# Altium schematic sheet jn5169_blk.SchDoc
size A4; Date: 1/11/2016; Engineer: JBayalas; DocumentNumber: 9; Revision: V1.0; SheetNumber: 9; SheetTotal: 11
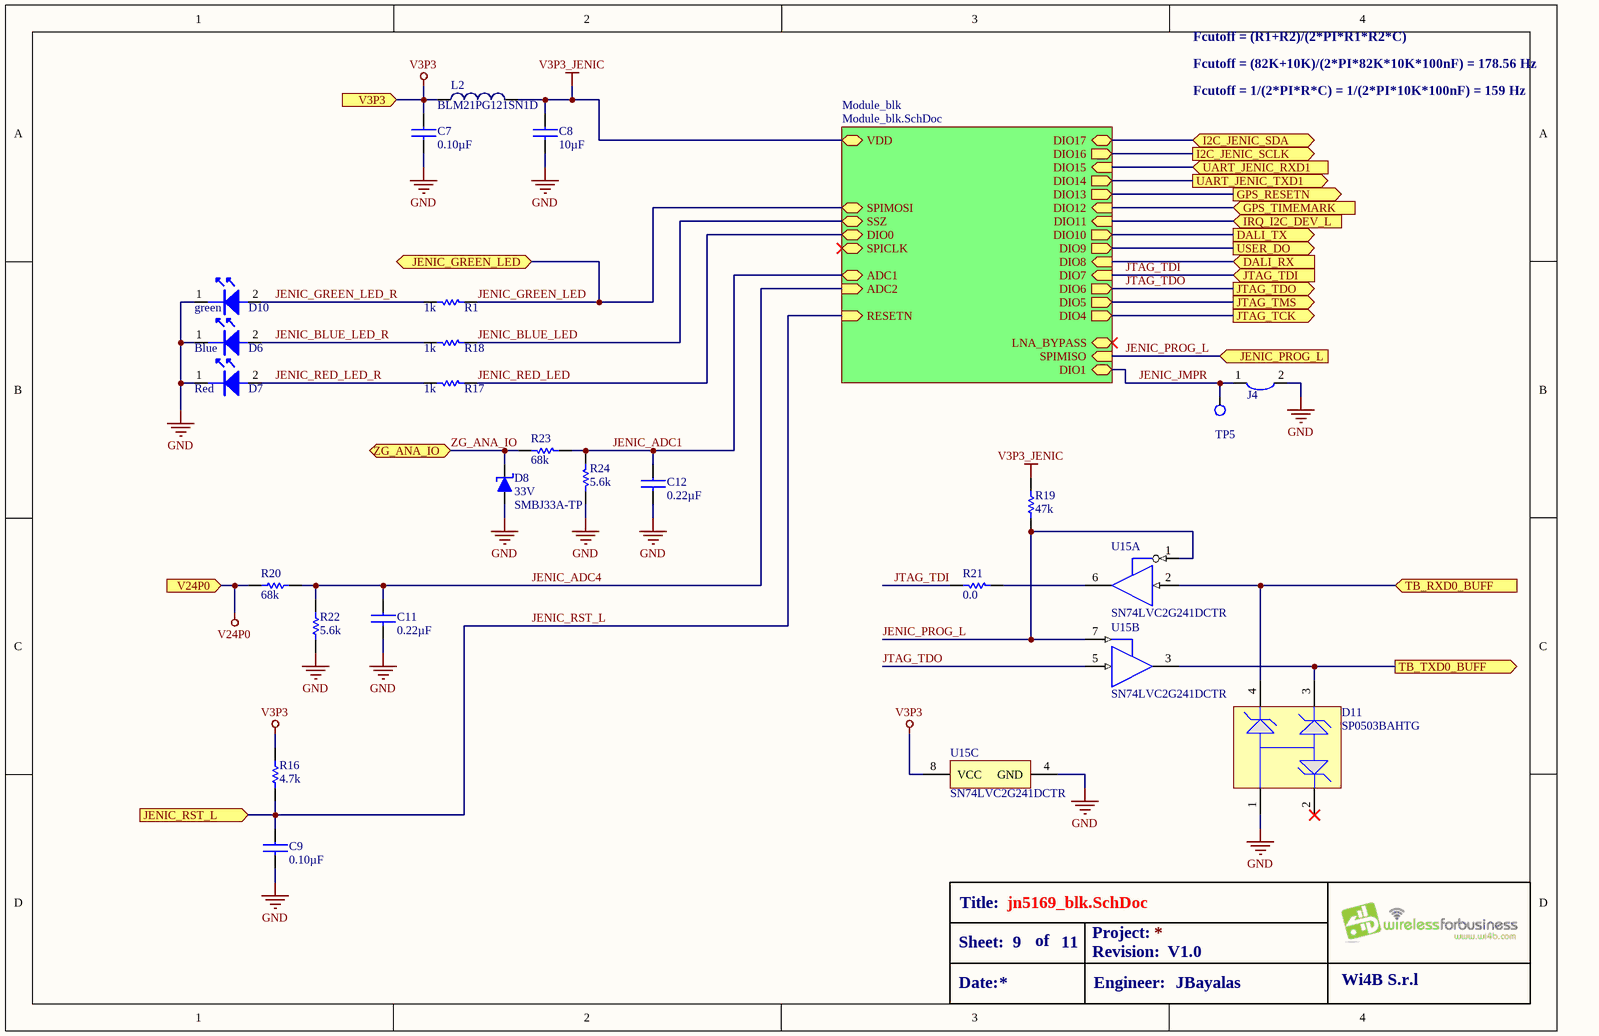
[diagram p0: jn5169_blk.SchDoc]

## Parts
C7  value 0.10µF  [C0402]  (hidden comment: GRM155R71H104ME14D)
C8  value 10µF  [C1206]  (hidden comment: GRM31CR71C106KAC7L)
C9  value 0.10µF  [C0402]  (hidden comment: GRM155R71H104ME14D)
C11  value 0.22µF  [C0603]  (hidden comment: GCM188R71H224KA64D)
C12  value 0.22µF  [C0603]  (hidden comment: GCM188R71H224KA64D)
D6  value Blue  [LED0402(BLUE)]  (hidden comment: VLMB1500-GS08)
D7  value Red  [LED0402(RED)]  (hidden comment: VLMS1500-GS08)
D8  RATING: 33V  [DO-214AA, SMB]  (hidden comment: SMBJ33A-TP)
D10  value green  [LED0402(GREEN)]  (hidden comment: XZVG68W-2)
D11  SP0503BAHTG  [LFUS-SOT143-4_V]
J4  0603 Jumper  [0603 Jumper]  (value not drawn)
L2  BLM21PG121SN1D  [0805 INDUCTOR]
R1  value 1k  [R0402]  (hidden comment: MCS04020C1001FE000)
R16  value 4.7k  [R0402]  (hidden comment: MCS04020C4701FE000)
R17  value 1k  [R0402]  (hidden comment: MCS04020C1001FE000)
R18  value 1k  [R0402]  (hidden comment: MCS04020C1001FE000)
R19  value 47k  [R0402]  (hidden comment: RC0402FR-0747KL)
R20  value 68k  [R0603]  (hidden comment: ERA-3AEB683V)
R21  value 0.0  [R0402]  (hidden comment: *)
R22  value 5.6k  [R0603]  (hidden comment: ERA-3AEB562V)
R23  value 68k  [R0603]  (hidden comment: ERA-3AEB683V)
R24  value 5.6k  [R0603]  (hidden comment: ERA-3AEB562V)
TP5  Test Point_2mm  [Test Point 2mm]  (value not drawn)
U15  SN74LVC2G241DCTR  [DCT0008A_L]  (parts A,B,C of 3)

## Sub-sheets
Module_blk = Module_blk.SchDoc: ADC1 (bidir), SPICLK (bidir), SPIMISO (in), SPIMOSI (bidir), SSZ (bidir), DIO0 (bidir), DIO1 (bidir), LNA_BYPASS (bidir), VDD (bidir), DIO10 (out), DIO9 (out), DIO8 (in), DIO7 (in), DIO6 (out), DIO5 (out), DIO4 (out), DIO17 (bidir), DIO16 (out), DIO15 (in), DIO14 (out), RESETN (in), DIO13 (out), DIO12 (in), DIO11 (in), ADC2 (in)

## Ports
DALI_RX (in), DALI_TX (out), GPS_RESETN (out), GPS_TIMEMARK (in), I2C_JENIC_SCLK (out), I2C_JENIC_SDA (bidir), IRQ_I2C_DEV_L (in), JENIC_GREEN_LED (bidir), JENIC_PROG_L (in), JENIC_RST_L (in), JTAG_TCK (out), JTAG_TDI (in), JTAG_TDO (out), JTAG_TMS (out), TB_RXD0_BUFF (in), TB_TXD0_BUFF (out), UART_JENIC_RXD1 (in), UART_JENIC_TXD1 (out), USER_DO (out), V3P3 (in), V24P0 (in), ZG_ANA_IO (bidir)

## Nets
GND: C7.2 C8.2 C9.2 C11.2 C12.2 D6.1 D7.1 D8.2(A) D10.1 D11.1 J4.2 R22.1 R24.1 U15.4(GND)
V3P3: C7.1 L2.2 R16.2 U15.8(VCC) ; port V3P3
V3P3_JENIC: C8.1 L2.1 R19.2 ; sheet Module_blk/VDD
V24P0: R20.2 ; port V24P0
DALI_RX: port DALI_RX, sheet Module_blk/DIO8
DALI_TX: port DALI_TX, sheet Module_blk/DIO10
GPS_RESETN: port GPS_RESETN, sheet Module_blk/DIO13
GPS_TIMEMARK: port GPS_TIMEMARK, sheet Module_blk/DIO12
I2C_JENIC_SCLK: port I2C_JENIC_SCLK, sheet Module_blk/DIO16
I2C_JENIC_SDA: port I2C_JENIC_SDA, sheet Module_blk/DIO17
IRQ_I2C_DEV_L: port IRQ_I2C_DEV_L, sheet Module_blk/DIO11
JENIC_ADC1: C12.1 R23.2 R24.2 ; sheet Module_blk/ADC1
JENIC_ADC4: C11.1 R20.1 R22.2 ; sheet Module_blk/ADC2
JENIC_BLUE_LED: R18.2 ; sheet Module_blk/SSZ
JENIC_BLUE_LED_R: D6.2 R18.1
JENIC_GREEN_LED: R1.2 ; port JENIC_GREEN_LED, sheet Module_blk/SPIMOSI
JENIC_GREEN_LED_R: D10.2 R1.1
JENIC_JMPR: J4.1 TP5.1 ; sheet Module_blk/DIO1
JENIC_PROG_L: R19.1 U15.1(1~{OE}) U15.7(2OE) ; port JENIC_PROG_L, sheet Module_blk/SPIMISO
JENIC_RED_LED: R17.2 ; sheet Module_blk/DIO0
JENIC_RED_LED_R: D7.2 R17.1
JENIC_RST_L: C9.1 R16.1 ; port JENIC_RST_L, sheet Module_blk/RESETN
JTAG_TCK: port JTAG_TCK, sheet Module_blk/DIO4
JTAG_TDI: R21.1 ; port JTAG_TDI, sheet Module_blk/DIO7
JTAG_TDO: U15.5(2A) ; port JTAG_TDO, sheet Module_blk/DIO6
JTAG_TMS: port JTAG_TMS, sheet Module_blk/DIO5
TB_RXD0_BUFF: D11.4 U15.2(1A) ; port TB_RXD0_BUFF
TB_TXD0_BUFF: D11.3 U15.3(2Y) ; port TB_TXD0_BUFF
UART_JENIC_RXD1: port UART_JENIC_RXD1, sheet Module_blk/DIO15
UART_JENIC_TXD1: port UART_JENIC_TXD1, sheet Module_blk/DIO14
USER_DO: port USER_DO, sheet Module_blk/DIO9
ZG_ANA_IO: D8.1(K) R23.1 ; port ZG_ANA_IO
NetR21_2: R21.2 U15.6(1Y)

Not connected (* = marked no-connect by the designer): D11 2*

## Notes on the sheet
- Fcutoff = (R1+R2)/(2*PI*R1*R2*C)
- Fcutoff = (82K+10K)/(2*PI*82K*10K*100nF) = 178.56 Hz
- Fcutoff = 1/(2*PI*R*C) = 1/(2*PI*10K*100nF) = 159 Hz
- Title:
- Sheet:
- Date:
- of
- Project:
- Revision:
- Engineer:
- Wi4B S.r.l

## Library data of the parts
C7 C9 = GRM155R71H104ME14D: CAP CER 0.1UF 50V X7R 0402; MFT: Murata Electronics North America; TYPE: SMD; MPN: GRM155R71H104ME14D; RATING: 50V; DNP: *
C8 = GRM31CR71C106KAC7L: CAP CER 10UF 16V X7R 1206; MFT: Murata Electronics North America; TYPE: SMD; MPN: GRM31CR71C106KAC7L; RATING: 16V; DNP: *
C11 C12 = GCM188R71H224KA64D: CAP CER 0.22UF 50V X7R 0603; MFT: Murata Electronics North America; TYPE: Surface Mount, MLCC; MPN: GCM188R71H224KA64D; RATING: 50V
D6 = VLMB1500-GS08: LED BLUE 0402 SMD; MFT: Vishay Semiconductor Opto Division; MPN: VLMB1500-GS08; TYPE: SMD; RATING: *; DNP: *
D7 = VLMS1500-GS08: LED RED 0402 SMD; MFT: Vishay Semiconductor Opto Division; MPN: VLMS1500-GS08; TYPE: SMD; RATING: *; DNP: *
D8 = SMBJ33A-TP: TVS DIODE 33VWM 53.3VC SMB; MFT: Micro Commercial Co; TYPE: Surface Mount; VALUE: SMBJ33A-TP; MPN: SMBJ33A-TP
D10 = XZVG68W-2: LED GREEN CLEAR CHIP SMD; MFT: SunLED; MPN: XZVG68W-2; RATING: *; LOAD: *; TYPE: SMD
D11 = CMP-2000-05191-1: TVS Diode Array, 30 pF, 30 KV, -40 to 85 degC, 4-Pin SOT143, RoHS, Tape and Reel; Manufacturer: Littelfuse; Direction Type: Uni-Directional; Product Height (mm): 1.05mm; Leakage Current (Max): 0.1uA; Clamping Voltage (Max): 8V; Reverse Stand-off Voltage: 5.5(Min)V; Configuration: Triple; Working Voltage: 5.5V; Product Length (mm): 3.04mm; Working Voltage (Max): 5.5V(Min); Capacitance Value: 30pF; Rad Hardened: No; Number of Elements: 3; Product Depth (mm): 1.4mm; Operating Temperature Max Deg. C: 85C; Suppressor Type: TVS; Operating Temperature Min Deg. C: -40C; Operating Temp Range: -40Cto85C; Mounting: SurfaceMount; Package / Case: SOT-143; Datasheet Version: Dec-13; Package Type: SOT-143; Packaging: TapeandReel; Pin Count: 3+Tab; Operating Temperature Classification: Industrial; Datasheet URL: https://datasheet.ciiva.com/15143/getdatasheetpartid-116020-15143550.pdf; Manufacturer URL: http://www.littelfuse.com/; Leakage Current: 0.1uA; Mounting Style: SurfaceMount; Clamping Voltage: 8V; Polarity: Uni-Directional
L2 = BLM21PG121SN1D: FERRITE CHIP 120 OHM 0805; MFT: Murata Electronics North America; RATING: 3A; TYPE: Surface Mount; VALUE: 120 Ohm; MPN: BLM21PG121SN1D
R1 R17 R18 = MCS04020C1001FE000: RES SMD 1K OHM 1% 1/10W 0402; MFT: Vishay Beyschlag; MPN: MCS04020C1001FE000; TYPE: SMD; RATING: 1/10W; DNP: *
R16 = MCS04020C4701FE000: RES SMD 4.7K OHM 1% 1/10W 0402; MFT: Vishay Beyschlag; MPN: MCS04020C4701FE000; TYPE: SMD; RATING: 1/10W; DNP: *
R19 = RC0402FR-0747KL: RES SMD 47K OHM 1% 1/16W 0402; MFT: Yageo; APN: RQ-0473-R7-C; MPN: RC0402FR-0747KL; LOAD: *; TYPE: SMD; RATING: 1/16W
R20 R23 = ERA-3AEB683V: RES SMD 68K OHM 0.1% 1/10W 0603; MFT: Panasonic Electronic Components; MPN: ERA-3AEB683V; TYPE: SMD; RATING: 1/10W
  R20: LOAD: *
  R23: DNP: *
R21 = CRCW04020000Z0ED: RES SMD 0.0OHM JUMPER 1/16W 0402; MFT: Vishay Dale; RATING: 63mW; MPN: CRCW04020000Z0ED; TYPE: Surface Mount
R22 R24 = ERA-3AEB562V: RES SMD 5.6K OHM 0.1% 1/10W 0603; MFT: Panasonic Electronic Components; MPN: ERA-3AEB562V; TYPE: SMD; RATING: 1/10W
  R22: LOAD: *
  R24: DNP: *
TP5 = Test Point_2mm: Test Point 2mm
U15 = CMP-0859-00564-3: Dual Buffer/Driver With 3-State Outputs, DCT0008A, LARGE T&R; Manufacturer: Texas Instruments; 3-State Output: Yes; tpd @ Nom Voltage(Max)(ns): 8.8,4.8,4.3,3.7; Rating: Catalog; Bits(#): 2; Technology Family: LVC; Logic: True; Voltage(Nom)(V): 1.8,2.5,3.3,5; Sub-Family: Non-Inverting Buffer/Driver; ICC @ Nom Voltage(Max)(mA): 0.01; F @ Nom Voltage(Max)(Mhz): 150; Schmitt Trigger: No; VCC(Min)(V): 1.65; Output Drive (IOL/IOH)(Max)(mA): 32/-32; Input Type: CMOS/TTL; Output Type: CMOS; VCC(Max)(V): 5.5; PackageReference: DCT0008A; Generic Part Number: SN74LVC2G241; Operating Temperature Range(C): -40 to 125; DatasheetVersion: SCES210N